# EAGLE design AC2DC (EAGLE 9.4.1)
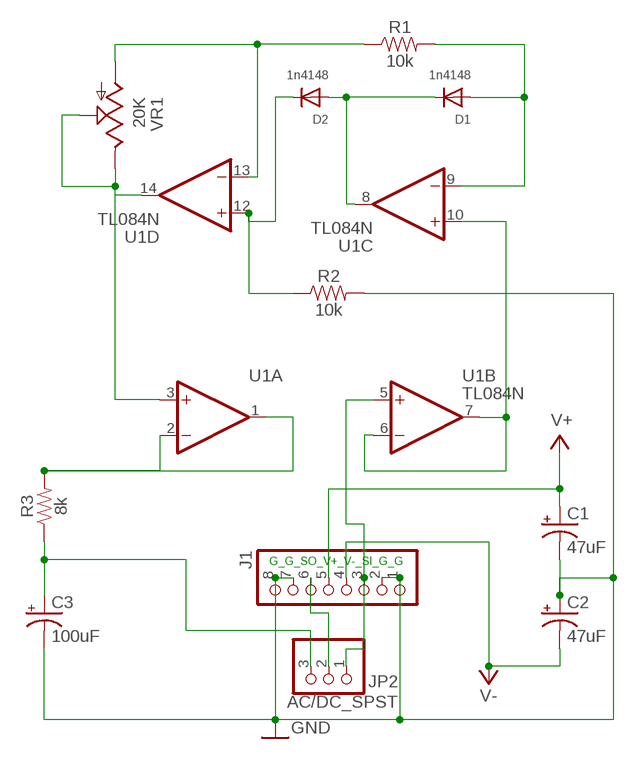
[diagram p0: schematic, sheet 1]

## Parts
AC/DC_SPST  JP2  PINHD-1X3  [1X03]
C1  47uF  CPOL-USE5-4  [E5-4]
C2  47uF  CPOL-USE5-4  [E5-4]
C3  100uF  CPOL-USE5-4  [E5-4]
D1  1n4148  DIODEDO-1N4148  [DO-1N4148]
D2  1n4148  DIODEDO-1N4148  [DO-1N4148]
G_G_SO_V+_V-_SI_G_G  J1  PINHD-1X8BIG  [1X08-BIG]
R1  10k  10KOHM-HORIZ-1/4W-5%  [AXIAL-0.3]
R2  10k  10KOHM-HORIZ-1/4W-5%  [AXIAL-0.3]
R3  8k  10KOHM-HORIZ-1/4W-5%  [AXIAL-0.3]
U1  TL084N  [DIL14]
VR1  20K  TRIM_US-S64W  [S64W]

## Nets
GND: C1.- C2.+ C3.- G_G_SO_V+_V-_SI_G_G.1 G_G_SO_V+_V-_SI_G_G.2 G_G_SO_V+_V-_SI_G_G.7 G_G_SO_V+_V-_SI_G_G.8 R2.P$2
N$1: AC/DC_SPST.3 C3.+ R3.P$1
N$2: U1.6(B:-IN) U1.7(B:OUT) U1.10(C:+IN)
N$3: R3.P$2 U1.1(A:OUT) U1.2(A:-IN)
N$4: R1.P$1 U1.13(D:-IN) VR1.A
N$5: U1.3(A:+IN) U1.14(D:OUT) VR1.E VR1.S
N$6: AC/DC_SPST.1 G_G_SO_V+_V-_SI_G_G.3 U1.5(B:+IN)
N$7: D1.C D2.A U1.8(C:OUT)
N$8: D1.A R1.P$2 U1.9(C:-IN)
N$9: AC/DC_SPST.2 G_G_SO_V+_V-_SI_G_G.6
N$10: D2.C R2.P$1 U1.12(D:+IN)
V+: C1.+ G_G_SO_V+_V-_SI_G_G.5
V-: C2.- G_G_SO_V+_V-_SI_G_G.4

## Power pins joined to a net without a drawn wire
V+: U1.4(P:V+)
V-: U1.11(P:V-)

## Library data of the parts
AC/DC_SPST = adafruit:PINHD-1X3: PIN HEADER
C1-C3 = adafruit:CPOL-US: POLARIZED CAPACITOR, American symbol
D1 D2 = adafruit:DIODE: Diode SMADIODE - SMA Surface Mount Package 20V 1A Schottky Diode Digikey: 641-1014-6-ND DO-1N4148 - Through Hole Small Current Diode SOD-123 20V 1 A (.5mV Vf) Schottky Diode - Digikey: MBRX120TPMSCT-ND SOD-323 10V 570mA (.38mV Vf, 3ns) Schottky Diode - Digikey: ZLLS410CT-ND SOD-523 30V 30mA Schottky Diode (RB751S-40TE61) - Digikey: RB751S-40TE61CT-ND SOT23-R/W - SOT23 Package (R = Solder Paste/Reflow Ovens, W = Hand-Soldering) BAT54Film 40V 300mA - Digikey: 497-7162-1-ND
G_G_SO_V+_V-_SI_G_G = adafruit:PINHD-1X8: PIN HEADER
R1 R2 = SparkFun-Resistors:10KOHM: 10kΩ resistor A resistor is a passive two-terminal electrical component that implements electrical resistance as a circuit element. Resistors act to reduce current flow, and, at the same time, act to lower voltage levels within circuits. - Wikipedia; PROD_ID: RES-09435
R3 = SparkFun-Resistors:10KOHM: 10kΩ resistor A resistor is a passive two-terminal electrical component that implements electrical resistance as a circuit element. Resistors act to reduce current flow, and, at the same time, act to lower voltage levels within circuits. - Wikipedia; PROD_ID: RES-09435; VALUE: 10k
U1 = op-amp:TL084: JFET OP-AMP - Quad
VR1 = pot:TRIM_US-: POTENTIOMETER

## Net classes
0 default: clearance 0.205 mm

## Board
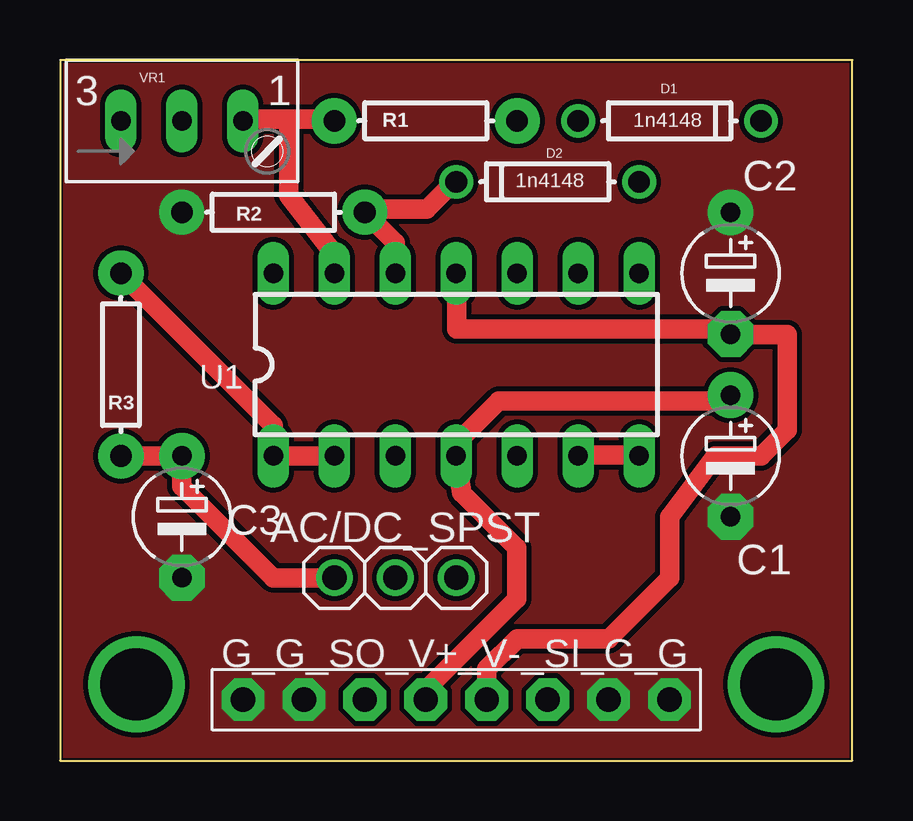
[diagram p1: board, top side]
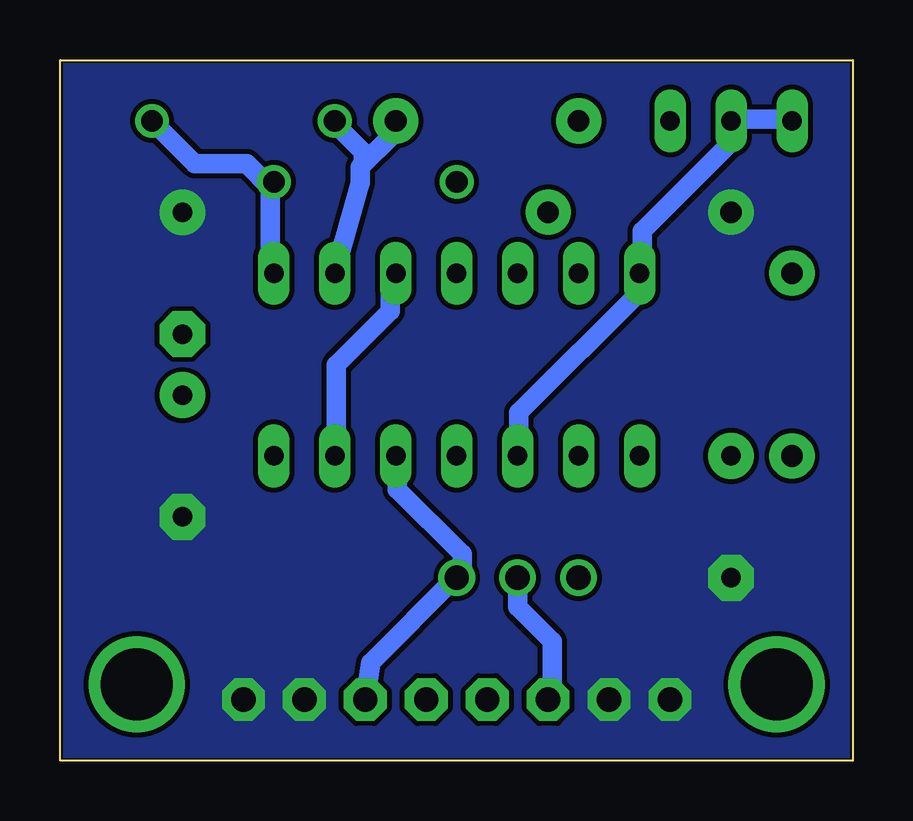
[diagram p2: board, bottom side, seen from below]

Size 33.04 x 29.21 mm. Coordinates in mm from the lower left corner, seen from the top.
Outline: 33.02,0 33.04,0
Outline: 33.02,0 0,0 0,29.21 33.02,29.21 33.02,0
Copper layers (1*16): Top 0.035mm / dielectric 1.5mm / Bottom 0.035mm
Design rules "Q *": minimum track width 6mil, minimum drill 0.35mm, track to track 6mil, track to pad 6mil, pad to pad 6mil, via to via 6mil, smd to smd 6mil, copper to edge 3mil, drill to drill 6mil, minimum pad ring 10mil, minimum via ring 8mil, stop-mask expansion 4mil, vias tented up to drill 0mil, thermal gap 0mil

### Footprints (pad centres in the part's own frame; a part is rotated, then mirrored left to right if it is on the bottom)
1X03 = drill 1.016: 1 -2.54,0; 2 0,0; 3 2.54,0
E5-4 = drill 0.813 pad 1.905: + -2.54,0 | drill 0.813 pad 1.905 octagon: - 2.54,0
DO-1N4148 = drill 0.9: A -3.81,0; C 3.81,0
1X08-BIG = drill 1.016 pad 1.778 octagon: 1 -8.89,0; 2 -6.35,0; 3 -3.81,0; 4 -1.27,0; 5 1.27,0; 6 3.81,0; 7 6.35,0; 8 8.89,0
AXIAL-0.3 = drill 0.9 pad 1.88: P$1 -3.81,0; P$2 3.81,0
DIL14 = drill 0.813 long: 1 -7.62,-3.81; 2 -5.08,-3.81; 3 -2.54,-3.81; 4 0,-3.81; 5 2.54,-3.81; 6 5.08,-3.81; 7 7.62,-3.81; 8 7.62,3.81; 9 5.08,3.81; 10 2.54,3.81; 11 0,3.81; 12 -2.54,3.81; 13 -5.08,3.81; 14 -7.62,3.81
S64W = drill 0.813 long: A 2.54,1.27; E -2.54,1.27; S 0,1.27

### Placement (x,y rotation side)
AC/DC_SPST  13.97,7.62 180 top
C1  27.94,12.7 270 top
C2  27.94,20.32 270 top
C3  5.08,10.16 270 top
D1  25.4,26.67 0 top
D2  20.32,24.13 180 top
G_G_SO_V+_V-_SI_G_G  16.51,2.54 180 top
R1  15.24,26.67 0 top
R2  8.89,22.86 180 top
R3  2.54,16.51 90 top
U1  16.51,16.51 0 top
VR1  5.08,25.4 0 top

### Tracks (layer width: path | path; a pad name or v marks a point on that pad's centre or on a via)
GND
  pour Top: 0,29.21 0,0 33.02,0 33.02,29.21
  pour Bottom: 0,0 33.02,0 33.02,29.21 0,29.21
N$1
  Top 0.813: AC/DC_SPST.3 8.89,7.62 5.08,11.43 C3.+ R3.P$1
N$2
  Top 0.813: U1.6 21.79,12.75 24.04,12.75 U1.7
  Bottom 0.813: U1.10 19.29,20.25 19.29,18.75 21.54,16.5 21.54,12.75 U1.6
N$3
  Top 0.813: U1.2 U1.1 8.89,13.97 R3.P$2
N$4
  Top 0.813: 9.54,26.75 11.29,26.75 R1.P$1 | 9.54,26.75 7.79,26.75 VR1.A | 9.54,26.75 9.54,23.55 11.43,21.12 U1.13
N$5
  Bottom 0.813: VR1.E 2.54,26.75 5.04,26.75 VR1.S 5.08,25.78 8.79,22.07 8.79,20.5 U1.14 8.79,20.25 8.79,19.64 13.93,14.5 13.93,12.71 U1.3
N$6
  Bottom 0.813: U1.5 18.98,11.3 16.29,8.61 16.29,7.75 AC/DC_SPST.1 16.56,7.62 20.1,4.08 G_G_SO_V+_V-_SI_G_G.3
N$7
  Bottom 0.813: 24.27,23.77 24.27,20.48 U1.8 | 24.27,23.77 24.29,23.75 24.29,24 D2.A | 24.27,23.77 24.21,23.83 25.26,24.88 27.42,24.88 D1.C
N$8
  Bottom 0.813: 20.41,24.88 19.29,26 19.29,26.5 R1.P$2 | 20.41,24.88 20.54,24.75 20.54,24.1 U1.9 | 20.41,24.88 20.41,25.37 21.54,26.5 D1.A
N$9
  Bottom 0.813: AC/DC_SPST.2 13.97,6.41 12.54,4.98 12.54,2.75 G_G_SO_V+_V-_SI_G_G.6
N$10
  Top 0.813: U1.12 13.97,21.59 R2.P$1 12.79,23 15.29,23 16.29,24 D2.C
N$11  (via drill 3)
  other vias: 3.18,3.18
N$12  (via drill 3)
  other vias: 29.84,3.18
V+
  Top 0.813: G_G_SO_V+_V-_SI_G_G.5 15.04,2.75 19.04,6.75 19.04,8.86 16.74,11.15 U1.4 16.29,13 18.29,15 27.79,15 C1.+
V-
  Top 0.813: U1.11 16.54,20.25 16.54,18 27.79,18 C2.- 27.95,17.75 30.29,17.75 30.29,13.78 29.21,12.7 27.3,12.7 25.4,10.16 25.4,7.62 22.86,5.08 19.05,5.08 17.79,3.82 17.79,2.75 G_G_SO_V+_V-_SI_G_G.4